# EAGLE design blueimu (EAGLE 7.2.0)
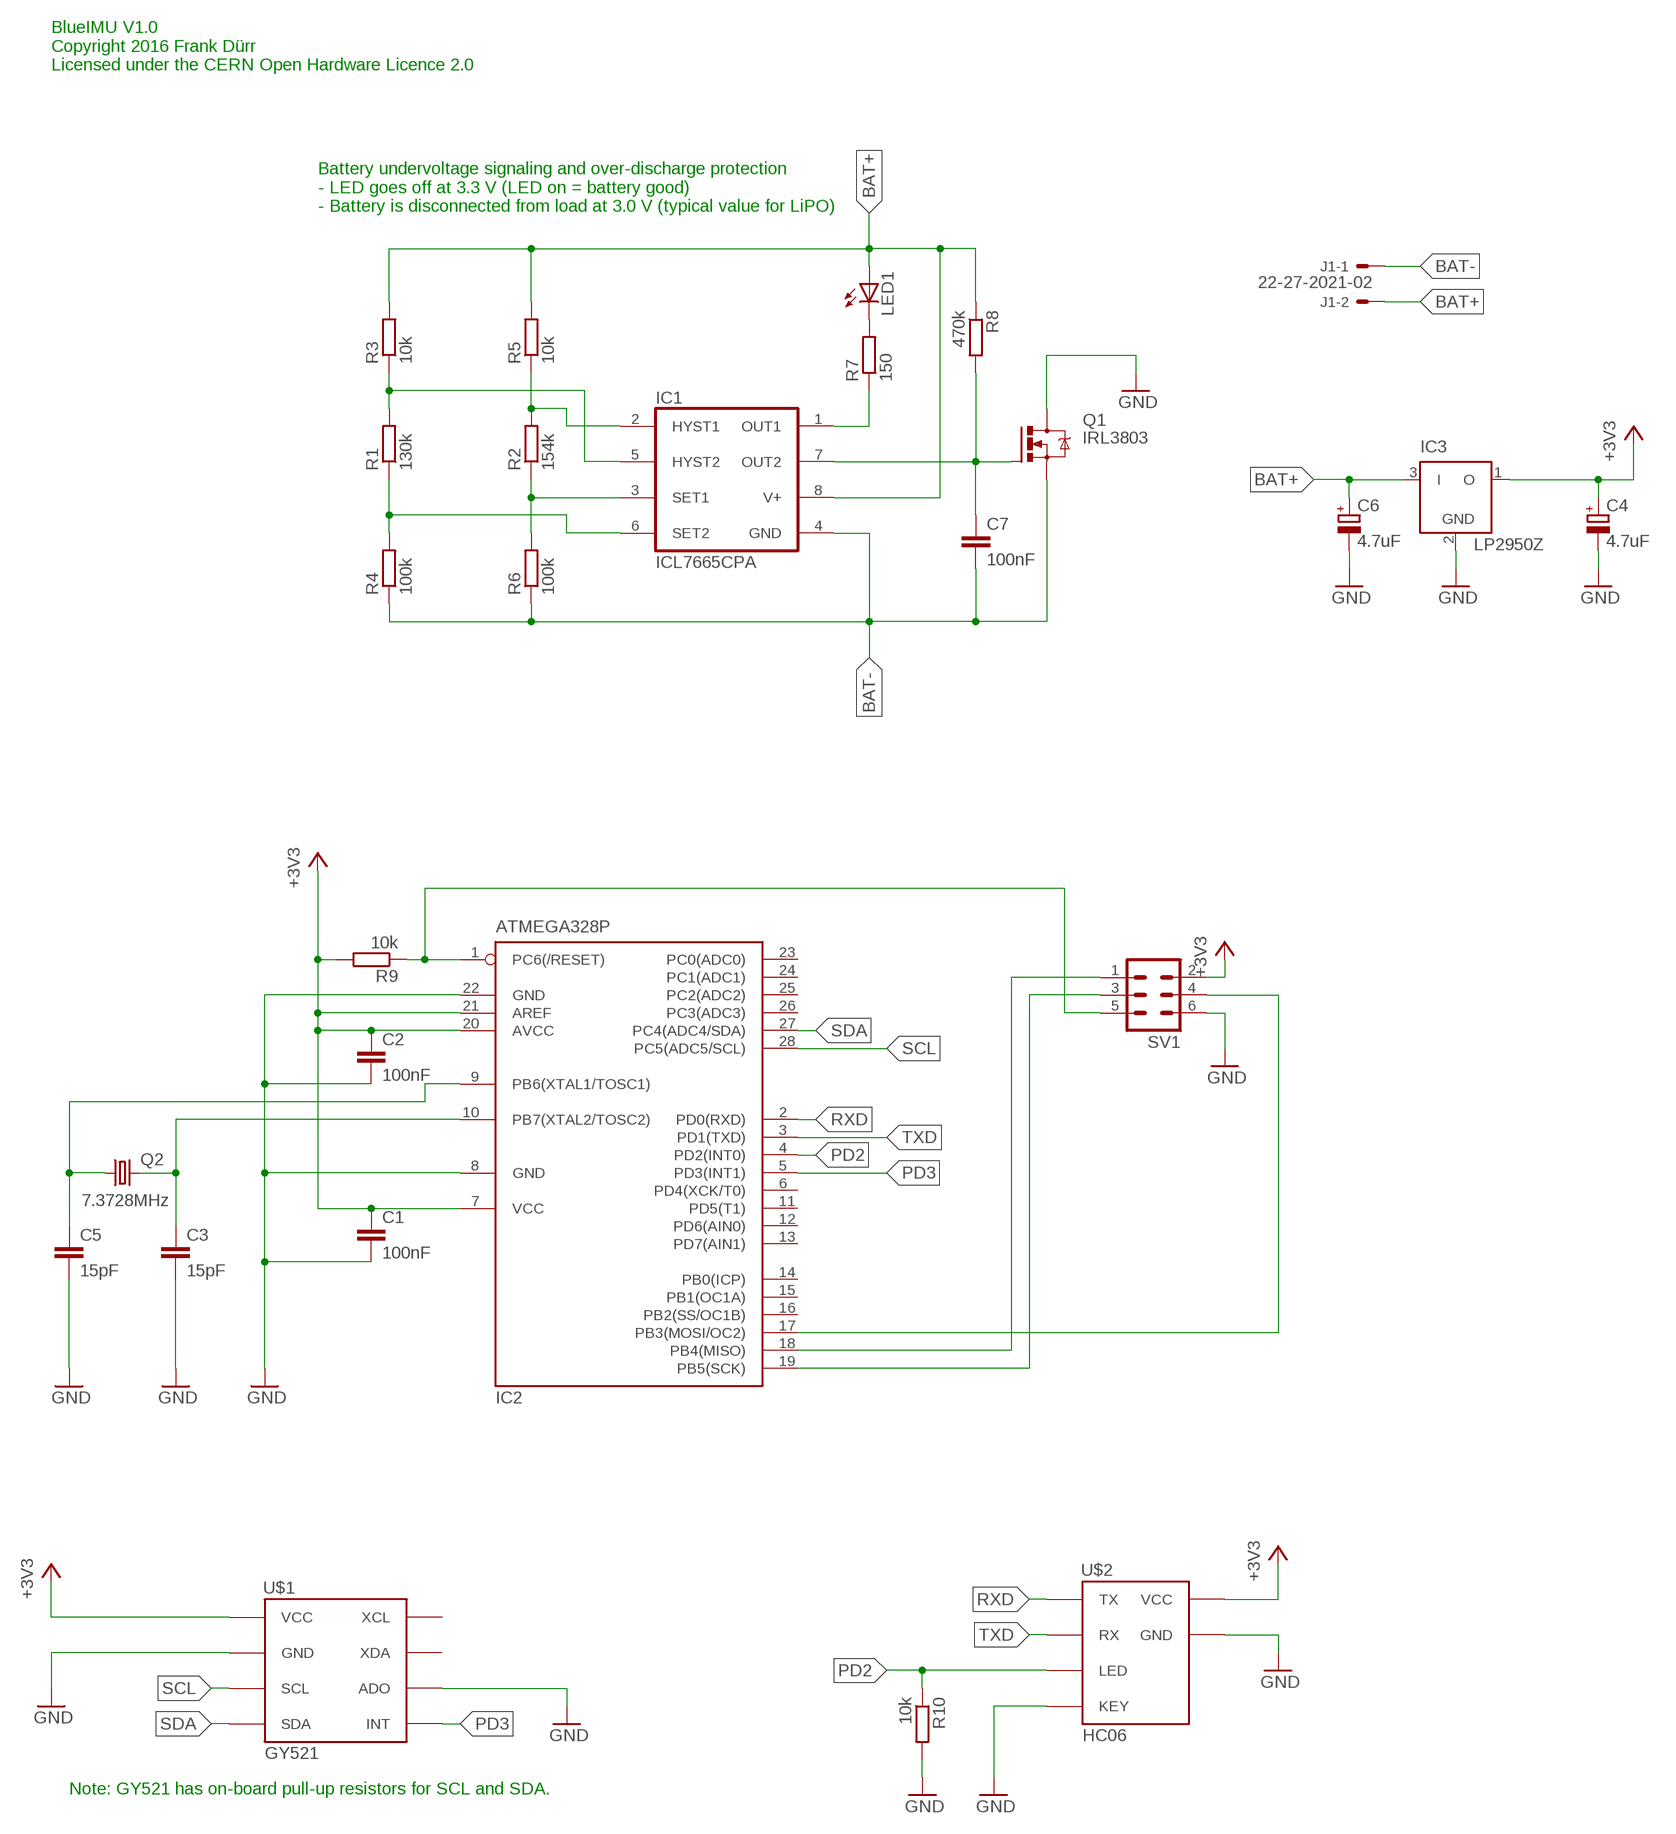
[diagram p0: schematic, sheet 1]

## Parts
C1  100nF  C-EU050-024X044  [C050-024X044]
C2  100nF  C-EU050-024X044  [C050-024X044]
C3  15pF  C-EU025-025X050  [C025-025X050]
C4  4.7uF  CPOL-EUE2.5-5  [E2,5-5]
C5  15pF  C-EU025-025X050  [C025-025X050]
C6  4.7uF  CPOL-EUE2.5-5  [E2,5-5]
C7  100nF  C-EU050-024X044  [C050-024X044]
IC1  ICL7665CPA  [DIL08]
IC2  ATMEGA328P  MEGA8-P  [DIL28-3]
IC3  LP2950Z  [TO92]
J1  22-27-2021-02  [6410-02]
LED1  LED3MM  [LED3MM]
Q1  IRL3803  IRF520  [TO220BV]
Q2  7.3728MHz  CRYSTALHC49U-V  [HC49U-V]
R1  130k  R-EU_0207/7  [0207/7]
R2  154k  R-EU_0207/7  [0207/7]
R3  10k  R-EU_0207/7  [0207/7]
R4  100k  R-EU_0207/7  [0207/7]
R5  10k  R-EU_0207/7  [0207/7]
R6  100k  R-EU_0207/7  [0207/7]
R7  150  R-EU_0207/7  [0207/7]
R8  470k  R-EU_0207/7  [0207/7]
R9  10k  R-EU_0207/7  [0207/7]
R10  10k  R-EU_0207/7  [0207/7]
SV1  MA03-2  [MA03-2]
U$1  GY521  [GY521]
U$2  HC06  [HC06]

## Nets
+3V3: C1.1 C2.1 C4.+ IC2.7(VCC) IC2.20(AVCC) IC2.21(AREF) IC3.1(O) R9.2 SV1.2 U$1.VCC U$2.VCC
BAT+: C6.+ IC1.8(V+) IC3.3(I) J1.2 LED1.A R3.2 R5.2 R8.1
BAT-: C7.2 IC1.4(GND) J1.1 Q1.S R4.1 R6.1
GND: C1.2 C2.2 C3.2 C4.- C5.2 C6.- IC2.8(GND) IC2.22(GND) IC3.2(GND) Q1.D R10.2 SV1.6 U$1.ADO U$1.GND U$2.GND U$2.KEY
N$1: LED1.K(C) R7.2
N$2: IC1.1(OUT1) R7.1
N$3: IC1.2(HYST1) R2.2 R5.1
N$4: IC1.3(SET1) R2.1 R6.2
N$5: IC2.18(PB4(MISO)) SV1.1
N$6: IC2.19(PB5(SCK)) SV1.3
N$7: IC2.17(PB3(MOSI/OC2)) SV1.4
N$8: IC2.1(PC6(/RESET)) R9.1 SV1.5
N$9: C7.1 IC1.7(OUT2) Q1.G R8.2
N$10: C3.1 IC2.10(PB7(XTAL2/TOSC2)) Q2.2
N$12: IC1.6(SET2) R1.1 R4.2
N$13: IC1.5(HYST2) R1.2 R3.1
N$15: C5.1 IC2.9(PB6(XTAL1/TOSC1)) Q2.1
PD2: IC2.4(PD2(INT0)) R10.1 U$2.LED
PD3: IC2.5(PD3(INT1)) U$1.INT
RXD: IC2.2(PD0(RXD)) U$2.TX
SCL: IC2.28(PC5(ADC5/SCL)) U$1.SCL
SDA: IC2.27(PC4(ADC4/SDA)) U$1.SDA
TXD: IC2.3(PD1(TXD)) U$2.RX
Unconnected: IC2.6(PD4(XCK/T0)) IC2.11(PD5(T1)) IC2.12(PD6(AIN0)) IC2.13(PD7(AIN1)) IC2.14(PB0(ICP)) IC2.15(PB1(OC1A)) IC2.16(PB2(SS/OC1B)) IC2.23(PC0(ADC0)) IC2.24(PC1(ADC1)) IC2.25(PC2(ADC2)) IC2.26(PC3(ADC3)) U$1.XCL U$1.XDA

## Notes on the sheet
- BlueIMU V1.0
  Copyright 2016 Frank Dürr
  Licensed under the CERN Open Hardware Licence 2.0
- Battery undervoltage signaling and over-discharge protection
  - LED goes off at 3.3 V (LED on = battery good)
  - Battery is disconnected from load at 3.0 V (typical value for LiPO)
- Note: GY521 has on-board pull-up resistors for SCL and SDA.

## Library data of the parts
C1-C3 C5 C7 = rcl:C-EU: CAPACITOR, European symbol
C4 C6 = rcl:CPOL-EU: POLARIZED CAPACITOR, European symbol
IC1 = maxim:ICL7665CPA: UNDER/OVER VOLTAGE DETECTOR; OC_FARNELL: unknown; OC_NEWARK: unknown
IC2 = atmel:MEGA8-P: MICROCONTROLLER 8 Kbytes FLASH, 1 kbytes SRAM, 512 bytes EEPROM, USART, 4-channel 10 bit ADC, 2-channel 8 bit ADC Pin compatible with Atmega48, ATMega88, ATMega168 Source: avr.lbr; OC_FARNELL: unknown; OC_NEWARK: unknown
IC3 = linear:LP2950: 100 mA, Low Power Low Dropout Voltage Regulator Source: http://www.onsemi.com/pub/Collateral/LP2950-D.PDF
J1 = con-molex:22-?-02: CONNECTOR wire to board 2.54 mm (.1 inch) pitch header; OC_FARNELL: unknown; OC_NEWARK: unknown
LED1 = led:LED: LED OSRAM: - CHIPLED LG R971, LG N971, LY N971, LG Q971, LY Q971, LO R971, LY R971 LH N974, LH R974 LS Q976, LO Q976, LY Q976 LO Q996 - Hyper CHIPLED LW Q18S LB Q993, LB Q99A, LB R99A - SideLED LS A670, LO A670, LY A670, LG A670, LP A670 LB A673, LV A673, LT A673, LW A673 LH A674 LY A675 LS A676, LA A676, LO A676, LY A676, LW A676 LS A679, LY A679, LG A679 - Hyper Micro SIDELED® LS Y876, LA Y876, LO Y876, LY Y876 LT Y87S - SmartLED LW L88C, LW L88S LB L89C, LB L89S, LG L890 LS L89K, LO L89K, LY L89K LS L896, LA L896, LO L896, LY L896 - TOPLED LS T670, LO T670, LY T670, LG T670, LP T670 LSG T670, LSP T670, LSY T670, LOP T670, LYG T670 LG T671, LOG T671, LSG T671 LB T673, LV T673, LT T673, LW T673 LH T674 LS T676, LA T676, LO T676, LY T676, LB T676, LH T676, LSB T676, LW T676 LB T67C, LV T67C, LT T67C, LS T67K, LO T67K, LY T67K, LW E67C LS E67B, LA E67B, LO E67B, LY E67B, LB E67C, LV E67C, LT E67C LW T67C LS T679, LY T679, LG T679 LS T770, LO T770, LY T770, LG T770, LP T770 LB T773, LV T773, LT T773, LW T773 LH T774 LS E675, LA E675, LY E675, LS T675 LS T776, LA T776, LO T776, LY T776, LB T776 LHGB T686 LT T68C, LB T68C - Hyper Mini TOPLED® LB M676 - Mini TOPLED Santana® LG M470 LS M47K, LO M47K, LY M47K Source: http://www.osram.convergy.de LUXEON: - LUMILED® LXK2-PW12-R00, LXK2-PW12-S00, LXK2-PW14-U00, LXK2-PW14-V00 LXK2-PM12-R00, LXK2-PM12-S00, LXK2-PM14-U00 LXK2-PE12-Q00, LXK2-PE12-R00, LXK2-PE12-S00, LXK2-PE14-T00, LXK2-PE14-U00 LXK2-PB12-K00, LXK2-PB12-L00, LXK2-PB12-M00, LXK2-PB14-N00, LXK2-PB14-P00, LXK2-PB14-Q00 LXK2-PR12-L00, LXK2-PR12-M00, LXK2-PR14-Q00, LXK2-PR14-R00 LXK2-PD12-Q00, LXK2-PD12-R00, LXK2-PD12-S00 LXK2-PH12-R00, LXK2-PH12-S00 LXK2-PL12-P00, LXK2-PL12-Q00, LXK2-PL12-R00 Source: www.luxeon.com KINGBRIGHT: KA-3528ASYC Source: www.kingbright.com
Q1 = transistor-power:IRF520: HEXFET Power MOSFET
Q2 = crystal:CRYSTAL: CRYSTAL; OC_FARNELL: 1666969; OC_NEWARK: unknown
R1-R10 = rcl:R-EU_: RESISTOR, European symbol
SV1 = con-lstb:MA03-2: PIN HEADER; OC_FARNELL: unknown; OC_NEWARK: unknown
U$1 = gy521:GY521
U$2 = hc06:HC06

## Board
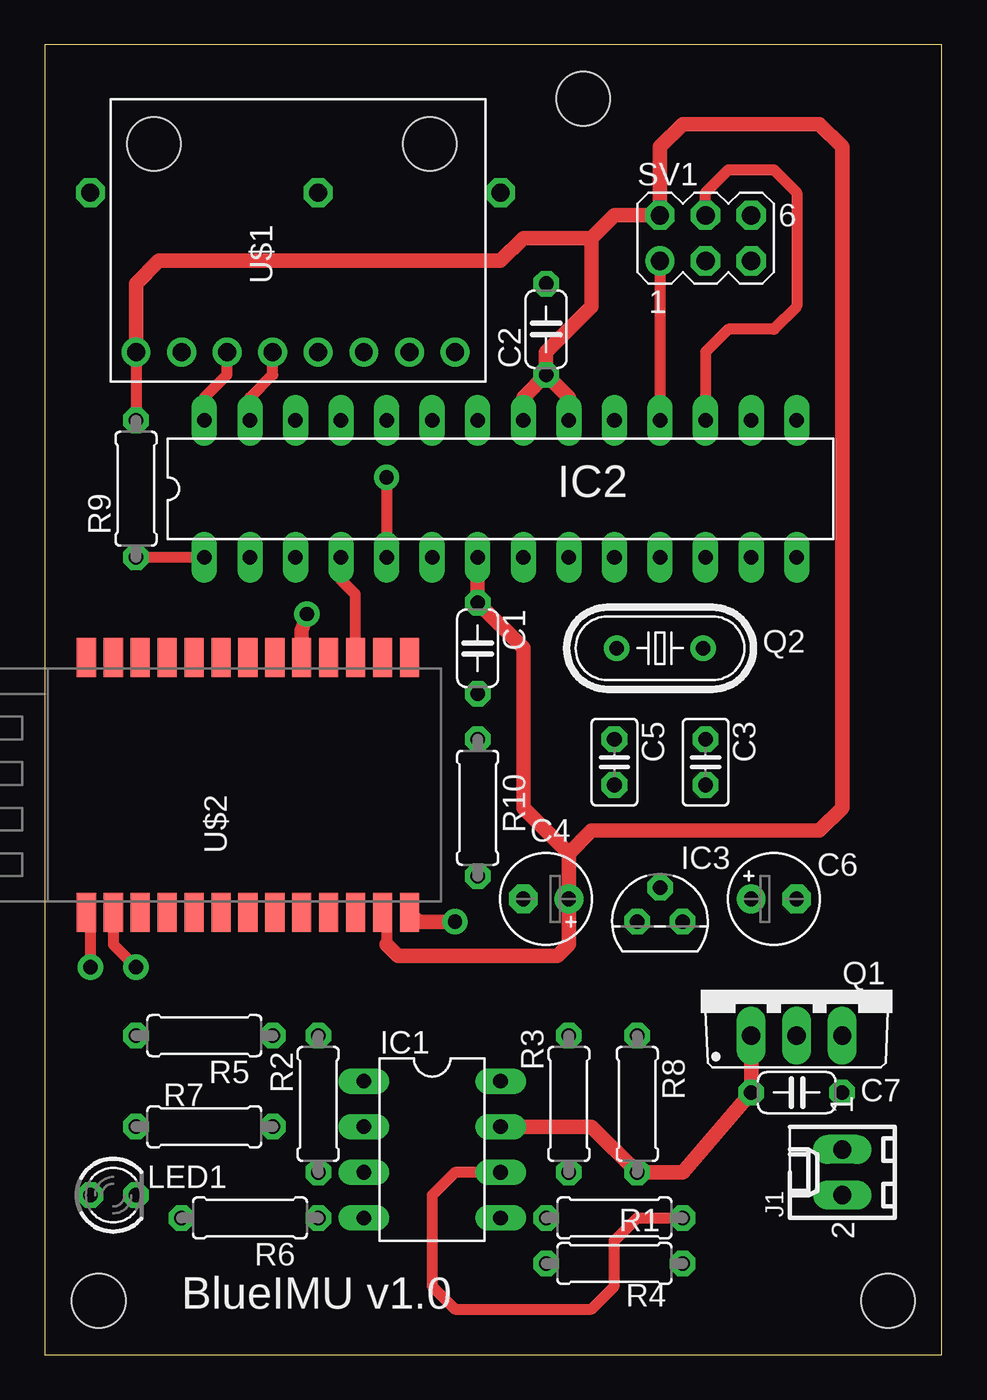
[diagram p1: board, top side]
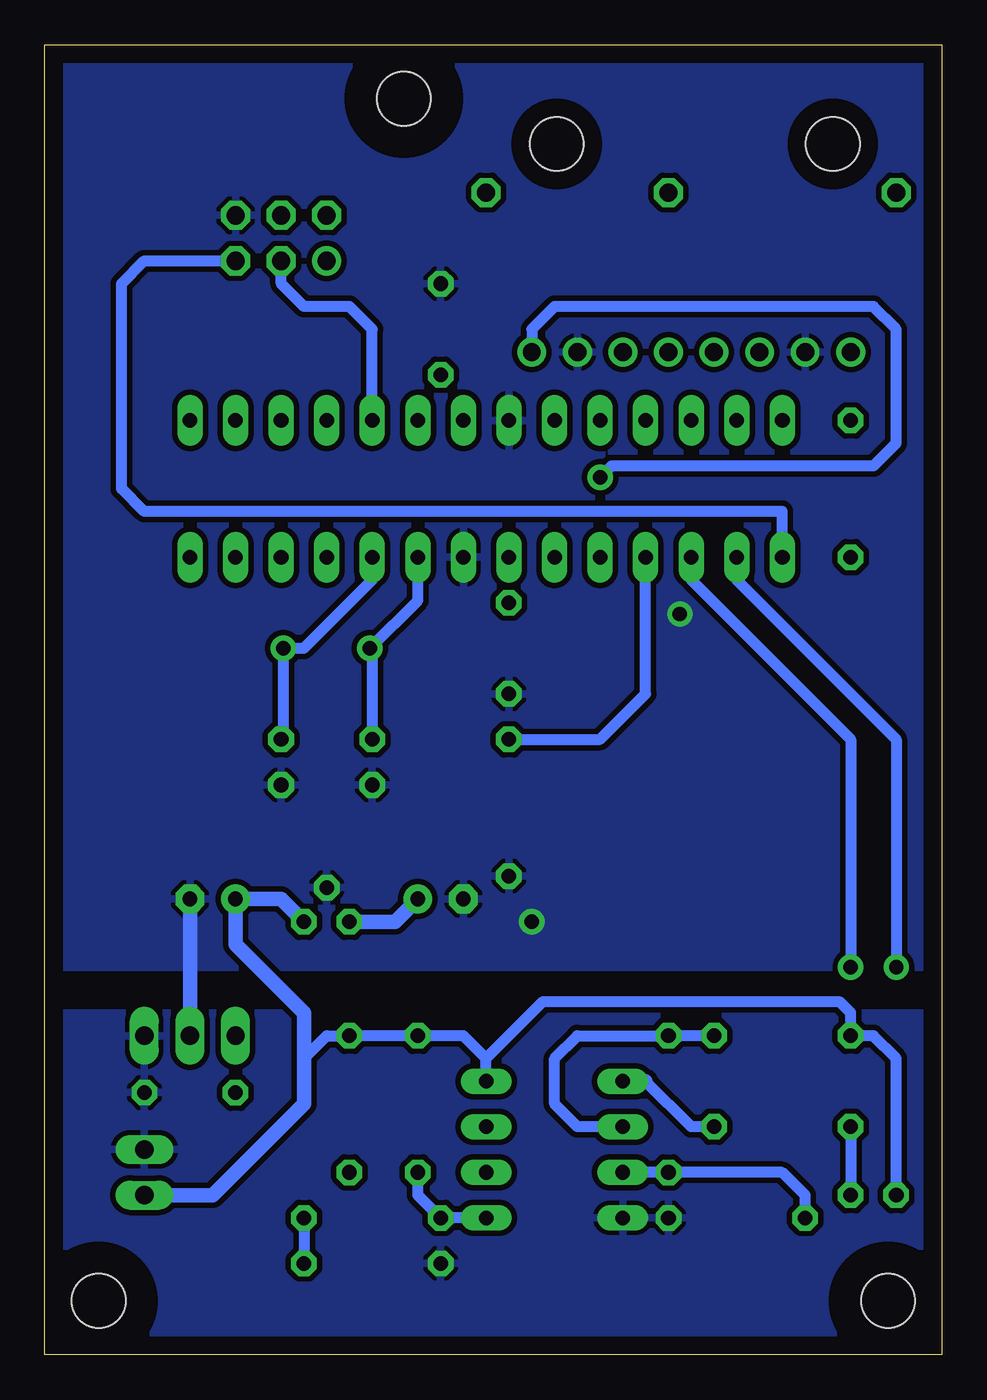
[diagram p2: board, bottom side, seen from below]

Size 50 x 73 mm. Coordinates in mm from the lower left corner, seen from the top.
Outline: 0,0 50,0 50,73 0,73 0,0
Copper layers (1*16): Top 0.035mm / dielectric 1.5mm / Bottom 0.035mm
Design rules "default *": minimum track width 10mil, minimum drill 24mil, track to track 12mil, track to pad 12mil, pad to pad 12mil, via to via 12mil, smd to smd 12mil, copper to edge 40mil, drill to drill 8mil, minimum pad ring 12mil, minimum via ring 12mil, stop-mask expansion 4mil, vias tented up to drill 0mil, thermal gap 10mil
Holes 3 mm at 3,3 47,3 30,70
bRestrict: area 43.7,-0.3 to 50.3,6.3; area -0.3,-0.3 to 6.3,6.3; area 26.7,66.7 to 33.3,73.3

### Footprints (pad centres in the part's own frame; a part is rotated, then mirrored left to right if it is on the bottom)
C050-024X044 = drill 0.813 octagon: 1 -2.54,0; 2 2.54,0
C025-025X050 = drill 0.813 octagon: 1 -1.27,0; 2 1.27,0
E2,5-5 = drill 0.813 pad 1.6: + -1.27,0 | drill 0.813 pad 1.6 octagon: - 1.27,0
DIL08 = drill 0.813 long: 1 -3.81,-3.81; 2 -1.27,-3.81; 3 1.27,-3.81; 4 3.81,-3.81; 5 3.81,3.81; 6 1.27,3.81; 7 -1.27,3.81; 8 -3.81,3.81
DIL28-3 = drill 0.813 long: 1 -16.51,-3.81; 2 -13.97,-3.81; 3 -11.43,-3.81; 4 -8.89,-3.81; 5 -6.35,-3.81; 6 -3.81,-3.81; 7 -1.27,-3.81; 8 1.27,-3.81; 9 3.81,-3.81; 10 6.35,-3.81; 11 8.89,-3.81; 12 11.43,-3.81; 13 13.97,-3.81; 14 16.51,-3.81; 15 16.51,3.81; 16 13.97,3.81; 17 11.43,3.81; 18 8.89,3.81; 19 6.35,3.81; 20 3.81,3.81; 21 1.27,3.81; 22 -1.27,3.81; 23 -3.81,3.81; 24 -6.35,3.81; 25 -8.89,3.81; 26 -11.43,3.81; 27 -13.97,3.81; 28 -16.51,3.81
TO92 = drill 0.813 octagon: 1 -1.27,0; 2 0,1.905; 3 1.27,0
6410-02 = drill 1.016 long: 1 1.27,0; 2 -1.27,0
LED3MM = drill 0.813 octagon: A -1.27,0; K 1.27,0
TO220BV = drill 1.016 long: D 0,-2.54; G -2.54,-2.54; S 2.54,-2.54
HC49U-V = drill 0.813: 1 -2.413,0; 2 2.413,0
0207/7 = drill 0.813 octagon: 1 -3.81,0; 2 3.81,0
MA03-2 = drill 1.016: 1 -2.54,-1.27 | drill 1.016 octagon: 2 -2.54,1.27; 3 0,-1.27; 4 0,1.27; 5 2.54,-1.27; 6 2.54,1.27
GY521 = drill 1: ADO -6.35,-6.35; GND -6.35,6.35; INT -6.35,-8.89; SCL -6.35,3.81; SDA -6.35,1.27; VCC -6.35,8.89; XCL -6.35,-3.81; XDA -6.35,-1.27 | hole 3: 5.25,7.89; 5.25,-7.49
HC06 = smd 2.184 x 1.067: GND -7.1,-8.89; KEY 7.1,-2.89; LED 7.1,-5.89; P$3 -7.1,-5.89; P$4 -7.1,-4.39; P$5 -7.1,-2.89; P$6 -7.1,-1.39; P$7 -7.1,0.11; P$8 -7.1,1.61; P$9 -7.1,3.11; P$10 -7.1,4.61; P$11 -7.1,6.11; P$14 7.1,-8.89; P$15 7.1,-7.39; P$17 7.1,-4.39; P$19 7.1,-1.39; P$20 7.1,0.11; P$21 7.1,1.61; P$22 7.1,3.11; P$23 7.1,4.61; P$24 7.1,6.11; P$25 7.1,7.61; P$26 7.1,9.11; RX -7.1,7.61; TX -7.1,9.11; VCC -7.1,-7.39

### Placement (x,y rotation side)
C1  24.13,39.37 270 top
C2  27.94,57.15 90 top
C3  36.83,33.02 270 top
C4  27.94,25.4 180 top
C5  31.75,33.02 270 top
C6  40.64,25.4 0 top
C7  41.91,14.61 0 top
IC1  21.59,11.43 270 top
IC2  25.4,48.26 0 top
IC3  34.29,24.13 0 top
J1  44.45,10.16 90 top
LED1  3.81,8.89 0 top
Q1  41.91,20.32 0 top
Q2  34.29,39.37 0 top
R1  31.75,7.62 180 top
R2  15.24,13.97 90 top
R3  29.21,13.97 90 top
R4  31.75,5.08 0 top
R5  8.89,17.78 180 top
R6  11.43,7.62 180 top
R7  8.89,12.7 180 top
R8  33.02,13.97 270 top
R9  5.08,48.26 90 top
R10  24.13,30.48 270 top
SV1  36.83,62.23 0 top
U$1  13.97,62.23 90 top
U$2  11.43,31.75 90 top

### Tracks (layer width: path | path; a pad name or v marks a point on that pad's centre or on a via)
+3V3
  Top 0.61: U$1.VCC R9.2 | U$2.VCC 19.05,24.42 19.05,22.86 | IC2.21 26.67,53.34
  Top 0.813: 29.21,27.94 C4.+ 29.21,22.86 28.57,22.23 19.68,22.23 19.05,22.86 | 29.21,27.94 26.67,30.48 26.67,39.37 C1.1 IC2.7 | 29.21,27.94 30.48,29.21 43.18,29.21 44.45,30.48 44.45,67.31 43.18,68.58 35.56,68.58 34.29,67.31 SV1.2 31.75,63.5 30.48,62.23 | 30.48,62.23 30.48,58.42 27.94,55.88 C2.1 | 26.67,53.34 C2.1 | C2.1 29.21,53.34 IC2.20 | U$1.VCC 5.08,59.69 6.35,60.96 25.4,60.96 26.67,62.23 30.48,62.23
  Bottom 0.813: IC3.1 30.48,24.13 C4.+
BAT+
  Bottom 0.61: IC1.8 25.4,16.51 | 25.4,16.51 26.67,17.78 R3.2 R8.1 34.29,17.78 35.56,16.51 | LED1.A 2.54,16.51 3.81,17.78 R5.2 5.08,19.05 5.71,19.68 22.23,19.68 25.4,16.51
  Bottom 0.813: J1.2 40.64,8.89 35.56,13.97 35.56,16.51 35.56,19.05 39.37,22.86 C6.+ 36.83,25.4 IC3.3
BAT-
  pour Bottom: -2.54,19.05 52.07,19.05 52.07,-1.27 -2.54,-1.27
GND  (via drill 0.8)
  Top 0.813: U$2.KEY 14.32,40.35 v14.61,41.27 | U$2.GND 20.84,24.13 v22.86,24.13
  Bottom 0.813: Q1.D C6.-
  pour Bottom: -1.27,73.66 52.07,73.66 52.07,21.59 -2.54,21.59 -2.54,71.12
N$1
  Bottom 0.61: R7.2 LED1.K
N$2
  Bottom 0.61: R7.1 13.97,12.7 16.51,15.24
  Bottom 0.813: 16.51,15.24 IC1.1
N$3
  Bottom 0.61: R5.1 R2.2 20.32,17.78 21.59,16.51 21.59,13.97 20.32,12.7 IC1.2
N$4
  Bottom 0.61: IC1.3 R2.1 8.89,10.16 7.62,8.89 R6.2
N$5
  Top 0.61: SV1.1 IC2.18
N$6
  Bottom 0.61: IC2.19 31.75,57.15 33.02,58.42 35.56,58.42 36.83,59.69 SV1.3
N$7
  Top 0.61: SV1.4 36.83,64.77 38.1,66.04 40.64,66.04 41.91,64.77 41.91,58.42 40.64,57.15 38.1,57.15 36.83,55.88 IC2.17
N$8
  Top 0.61: R9.1 IC2.1
  Bottom 0.61: IC2.1 8.89,46.99 44.45,46.99 45.72,48.26 45.72,59.69 44.45,60.96 SV1.5
N$9
  Top 0.813: IC1.7 30.48,12.7 R8.2 35.56,10.16 C7.1 Q1.G
N$10
  Bottom 0.61: C3.1 arc-90 36.7,34.42 Q2.2 35.56,39.37 31.75,43.18 IC2.10
N$11  (via drill 1)
  other vias: 2.54,64.77
N$12
  Top 0.61: IC1.6 22.86,10.16 21.59,8.89 21.59,3.81 22.86,2.54 30.48,2.54 31.75,3.81 31.75,6.35 33.02,7.62 R1.1
  Bottom 0.61: R1.1 R4.2
N$13
  Bottom 0.61: IC1.5 R1.2 29.21,8.89 R3.1
N$14  (via drill 1)
  other vias: 25.4,64.77
N$15
  Bottom 0.61: C5.1 31.75,39.24 Q2.1 29.21,42.04 IC2.9
N$16  (via drill 1)
  other vias: 15.24,64.77
PD2
  Top 0.61: U$2.LED 17.32,42.37 16.51,43.18 IC2.4
  Bottom 0.61: R10.1 19.05,34.29 16.51,36.83 IC2.4
PD3  (via drill 0.8)
  Top 0.61: v19.05,48.9 IC2.5
  Bottom 0.61: v19.05,48.9 18.41,49.53 3.81,49.53 2.54,50.8 2.54,57.15 3.81,58.42 21.59,58.42 22.86,57.15 U$1.INT
RXD  (via drill 0.8)
  Top 0.61: U$2.TX 2.54,24.43 v2.54,21.59
  Bottom 0.61: IC2.2 11.43,43.18 2.54,34.29 v2.54,21.59
SCL
  Top 0.61: IC2.28 8.89,53.34 10.16,54.61 U$1.SCL
SDA
  Top 0.61: IC2.27 11.43,53.34 12.7,54.61 U$1.SDA
TXD  (via drill 0.8)
  Top 0.61: 3.82,22.86 3.81,22.86 | 3.81,22.86 v5.08,21.59 | U$2.RX 3.81,22.86
  Bottom 0.61: v5.08,21.59 5.08,34.29 13.97,43.18 IC2.3

### Text on the board
tPlace: BlueIMU v1.0